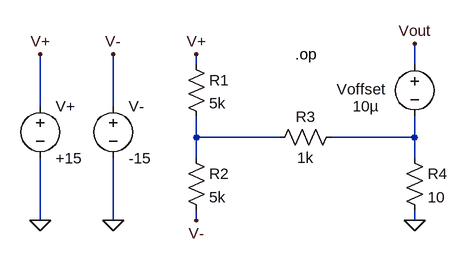
[diagram p0: schematic offset.asc]
offset.asc, the LTspice schematic file:
Version 4
SHEET 1 1188 740
WIRE -208 416 -208 400
WIRE 128 416 128 384
WIRE -448 480 -448 400
WIRE -336 480 -336 400
WIRE -208 528 -208 496
WIRE -80 528 -208 528
WIRE 128 528 128 496
WIRE 128 528 0 528
WIRE -208 560 -208 528
WIRE 128 560 128 528
WIRE -448 656 -448 560
WIRE -336 656 -336 560
WIRE -208 656 -208 640
WIRE 128 656 128 640
FLAG -448 400 V+
FLAG -448 656 0
FLAG -336 656 0
FLAG -336 400 V-
FLAG -208 400 V+
FLAG 128 656 0
FLAG 128 384 Vout
FLAG -208 656 V-
SYMBOL voltage -448 464 R0
SYMATTR InstName V+
SYMATTR Value +15
SYMBOL voltage 128 400 R0
WINDOW 0 -120 54 Left 2
WINDOW 3 -95 80 Left 2
SYMATTR InstName Voffset
SYMATTR Value 10µ
SYMBOL res -224 400 R0
SYMATTR InstName R1
SYMATTR Value 5k
SYMBOL res -224 544 R0
SYMATTR InstName R2
SYMATTR Value 5k
SYMBOL res 16 512 R90
WINDOW 0 0 56 VBottom 2
WINDOW 3 32 56 VTop 2
SYMATTR InstName R3
SYMATTR Value 1k
SYMBOL voltage -336 464 R0
SYMATTR InstName V-
SYMATTR Value -15
SYMBOL res 112 544 R0
SYMATTR InstName R4
SYMATTR Value 10
TEXT -56 400 Left 2 !.op

The netlist it stands for:
* offset.asc
V+ V+ 0 +15
Voffset Vout N002 10µ
R1 V+ N001 5k
R2 N001 V- 5k
R3 N002 N001 1k
V- V- 0 -15
R4 N002 0 10
.op
.backanno
.end